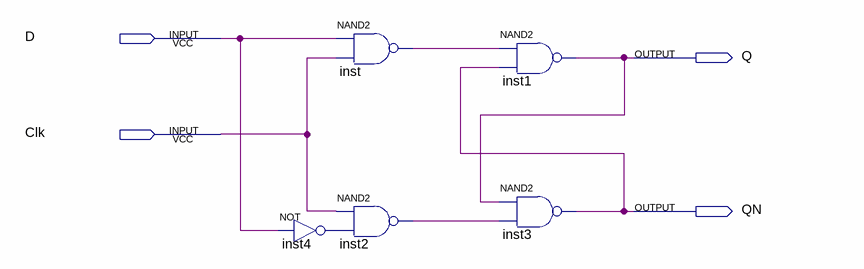
[diagram p0: schematic sheet]
// Quartus schematic lab9step2.bdf as structural Verilog: 5 symbols, 4 pins
module lab9step2 (
  input  D,
  input  Clk,
  output Q,
  output QN
);

  wire inst2_out, inst4_out, inst_out;

  nand inst (inst_out, D, Clk);
  nand inst2 (inst2_out, Clk, inst4_out);
  not inst4 (inst4_out, D);
  nand inst1 (Q, inst_out, QN);
  nand inst3 (QN, Q, inst2_out);
endmodule
